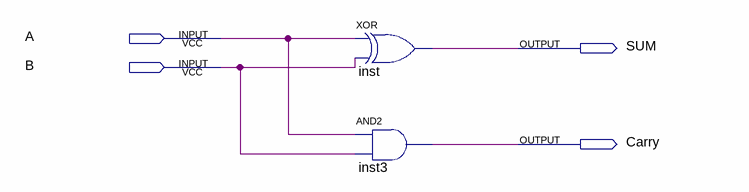
[diagram p0: schematic sheet]
// Quartus schematic Half_Adder.bdf as structural Verilog: 2 symbols, 4 pins
module Half_Adder (
  input  A,
  input  B,
  output SUM,
  output Carry
);

  xor inst (SUM, A, B);
  and inst3 (Carry, A, B);
endmodule
